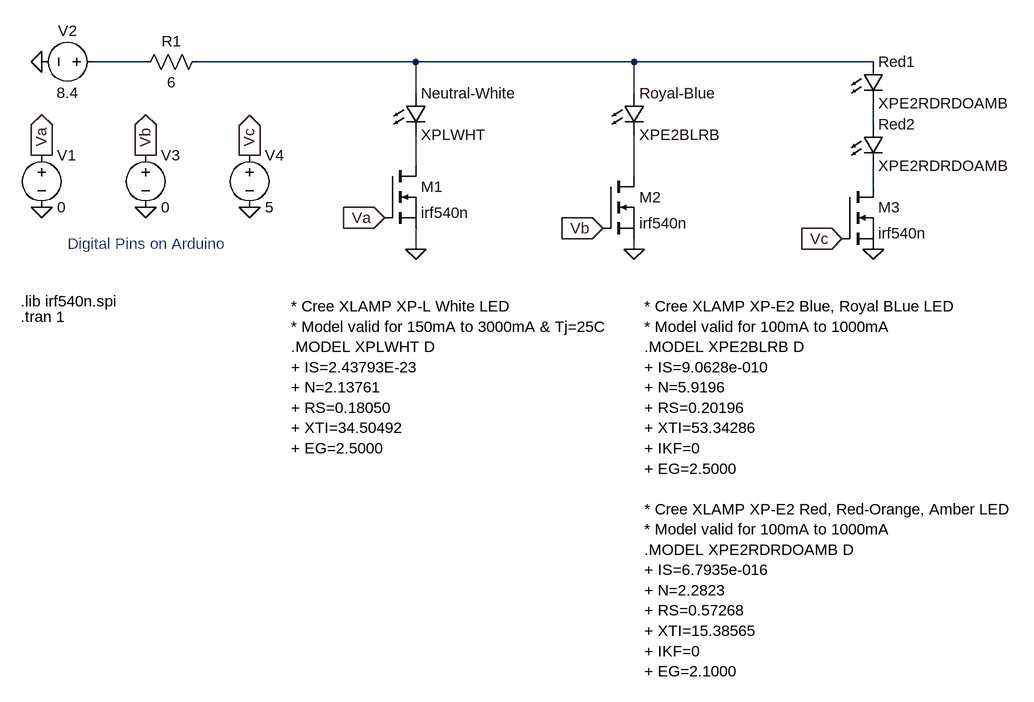
[diagram p0: schematic Sensor_test.asc]
Sensor_test.asc, the LTspice schematic file:
Version 4
SHEET 1 964 2016
WIRE -1264 320 -1344 320
WIRE -848 320 -1184 320
WIRE -512 320 -848 320
WIRE -144 320 -512 320
WIRE -848 368 -848 320
WIRE -512 368 -512 320
WIRE -144 416 -144 384
WIRE -848 480 -848 432
WIRE -512 496 -512 432
WIRE -144 512 -144 480
WIRE -848 608 -848 576
WIRE -512 608 -512 592
FLAG -1424 320 0
FLAG -512 608 0
FLAG -144 608 0
FLAG -848 608 0
FLAG -1424 464 Va
IOPIN -1424 464 Out
FLAG -1264 464 Vb
IOPIN -1264 464 Out
FLAG -1104 464 Vc
IOPIN -1104 464 Out
FLAG -1424 544 0
FLAG -1264 544 0
FLAG -1104 544 0
FLAG -896 560 Va
IOPIN -896 560 In
FLAG -560 576 Vb
IOPIN -560 576 In
FLAG -192 592 Vc
IOPIN -192 592 In
SYMBOL res -1168 304 R90
WINDOW 0 0 56 VBottom 2
WINDOW 3 32 56 VTop 2
SYMATTR InstName R1
SYMATTR Value 6
SYMBOL voltage -1328 320 R90
WINDOW 0 -32 56 VBottom 2
WINDOW 3 32 56 VTop 2
WINDOW 123 0 0 Left 0
WINDOW 39 0 0 Left 0
SYMATTR InstName V2
SYMATTR Value 8.4
SYMBOL LED -864 368 R0
SYMATTR InstName Neutral-White
SYMATTR Value XPLWHT
SYMBOL LED -528 368 R0
SYMATTR InstName Royal-Blue
SYMATTR Value XPE2BLRB
SYMBOL nmos -560 496 R0
SYMATTR InstName M2
SYMATTR Value irf540n
SYMATTR Prefix X
SYMBOL nmos -192 512 R0
SYMATTR InstName M3
SYMATTR Value irf540n
SYMATTR Prefix X
SYMBOL nmos -896 480 R0
SYMATTR InstName M1
SYMATTR Value irf540n
SYMATTR Prefix X
SYMBOL voltage -1424 448 R0
WINDOW 123 0 0 Left 0
WINDOW 39 0 0 Left 0
SYMATTR InstName V1
SYMATTR Value 0
SYMBOL voltage -1264 448 R0
WINDOW 123 0 0 Left 0
WINDOW 39 0 0 Left 0
SYMATTR InstName V3
SYMATTR Value 0
SYMBOL voltage -1104 448 R0
WINDOW 123 0 0 Left 0
WINDOW 39 0 0 Left 0
SYMATTR InstName V4
SYMATTR Value 5
SYMBOL LED -160 320 R0
SYMATTR InstName Red1
SYMATTR Value XPE2RDRDOAMB
SYMBOL LED -160 416 R0
SYMATTR InstName Red2
SYMATTR Value XPE2RDRDOAMB
TEXT -1456 712 Left 2 !.tran 1
TEXT -1456 688 Left 2 !.lib irf540n.spi
TEXT -496 696 Left 2 !* Cree XLAMP XP-E2 Blue, Royal BLue LED\n* Model valid for 100mA to 1000mA\n.MODEL XPE2BLRB D\n+ IS=9.0628e-010\n+ N=5.9196\n+ RS=0.20196\n+ XTI=53.34286\n+ IKF=0\n+ EG=2.5000\n \n* Cree XLAMP XP-E2 Red, Red-Orange, Amber LED\n* Model valid for 100mA to 1000mA\n.MODEL XPE2RDRDOAMB D\n+ IS=6.7935e-016\n+ N=2.2823\n+ RS=0.57268\n+ XTI=15.38565\n+ IKF=0\n+ EG=2.1000
TEXT -1040 696 Left 2 !* Cree XLAMP XP-L White LED\n* Model valid for 150mA to 3000mA & Tj=25C\n.MODEL XPLWHT D\n+ IS=2.43793E-23\n+ N=2.13761\n+ RS=0.18050\n+ XTI=34.50492\n+ EG=2.5000
TEXT -1384 600 Left 2 ;Digital Pins on Arduino

The netlist it stands for:
* Sensor_test.asc
R1 N002 N001 6
V2 N001 0 8.4
D§Neutral-White N002 N004 XPLWHT
D§Royal-Blue N002 N005 XPE2BLRB
XM2 N005 Vb 0 irf540n  ; pins D G S
XM3 N006 Vc 0 irf540n  ; pins D G S
XM1 N004 Va 0 irf540n  ; pins D G S
V1 Va 0 0
V3 Vb 0 0
V4 Vc 0 5
D§Red1 N002 N003 XPE2RDRDOAMB
D§Red2 N003 N006 XPE2RDRDOAMB
.model D D
.lib standard.dio
.tran 1
.lib irf540n.spi
* Cree XLAMP XP-E2 Blue, Royal BLue LED
* Model valid for 100mA to 1000mA
.MODEL XPE2BLRB D
+ IS=9.0628e-010
+ N=5.9196
+ RS=0.20196
+ XTI=53.34286
+ IKF=0
+ EG=2.5000
* Cree XLAMP XP-E2 Red, Red-Orange, Amber LED
* Model valid for 100mA to 1000mA
.MODEL XPE2RDRDOAMB D
+ IS=6.7935e-016
+ N=2.2823
+ RS=0.57268
+ XTI=15.38565
+ IKF=0
+ EG=2.1000
* Cree XLAMP XP-L White LED
* Model valid for 150mA to 3000mA & Tj=25C
.MODEL XPLWHT D
+ IS=2.43793E-23
+ N=2.13761
+ RS=0.18050
+ XTI=34.50492
+ EG=2.5000
* Digital Pins on Arduino
.backanno
.end